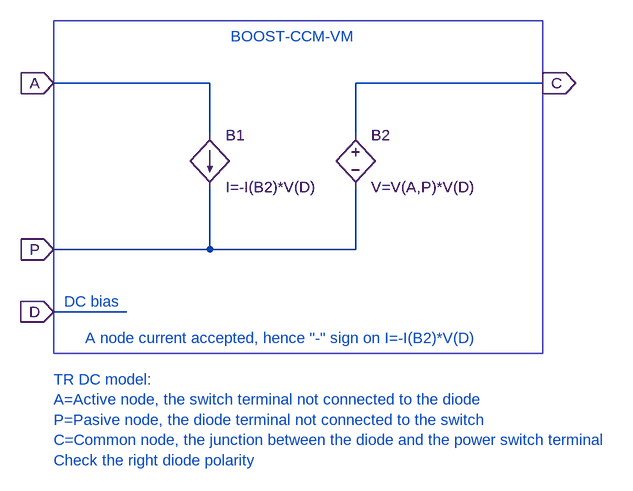
[diagram p0: schematic BOOST-CCM-VM.asc]
BOOST-CCM-VM.asc, the LTspice schematic file:
Version 4
SHEET 1 944 680
WIRE 192 32 -48 32
WIRE 704 32 416 32
WIRE 192 112 192 32
WIRE 416 112 416 32
WIRE 192 288 192 192
WIRE 192 288 -48 288
WIRE 416 288 416 192
WIRE 416 288 192 288
WIRE 64 384 -48 384
FLAG -48 32 A
IOPIN -48 32 In
FLAG -48 288 P
IOPIN -48 288 In
FLAG 704 32 C
IOPIN 704 32 Out
FLAG -48 384 D
IOPIN -48 384 In
SYMBOL bi 192 112 R0
SYMATTR InstName B1
SYMATTR Value I=-I(B2)*V(D)
SYMBOL bv 416 96 R0
SYMATTR InstName B2
SYMATTR Value V=V(A,P)*V(D)
TEXT 224 -40 Left 0 ;BOOST-CCM-VM
TEXT 0 424 Left 0 ;A node current accepted, hence "-" sign on I=-I(B2)*V(D)
TEXT -48 488 Left 0 ;TR DC model:\nA=Active node, the switch terminal not connected to the diode\nP=Pasive node, the diode terminal not connected to the switch\nC=Common node, the junction between the diode and the power switch terminal\nCheck the right diode polarity
TEXT -32 368 Left 0 ;DC bias
RECTANGLE Normal 704 448 -48 -64

The netlist it stands for:
* BOOST-CCM-VM.asc
B1 A P I=-I(B2)*V(D)
B2 C P V=V(A,P)*V(D)
* BOOST-CCM-VM
* A node current accepted, hence "-" sign on I=-I(B2)*V(D)
* TR DC model:
* A=Active node, the switch terminal not connected to the diode
* P=Pasive node, the diode terminal not connected to the switch
* C=Common node, the junction between the diode and the power switch terminal
* Check the right diode polarity
* DC bias
.backanno
.end